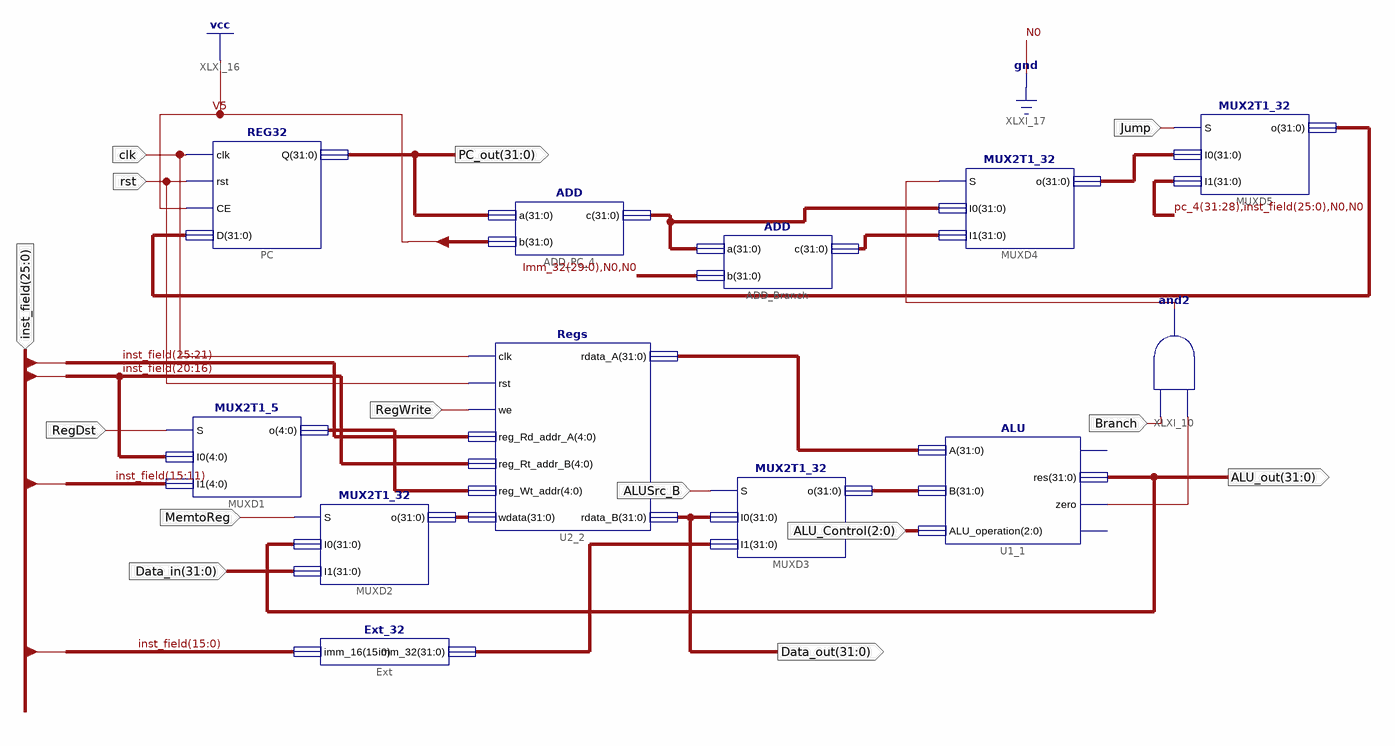
[diagram p0: schematic sheet 1]
// Xilinx ISE schematic Data_path.sch (kintex7) as structural Verilog: 12 symbols, 14 ports
module Data_path (
  input  clk,
  input  rst,
  input  Jump,
  input  Branch,
  input  [2:0] ALU_Control,
  input  [31:0] Data_in,
  input  MemtoReg,
  input  [25:0] inst_field,
  input  RegDst,
  input  RegWrite,
  input  ALUSrc_B,
  output [31:0] Data_out,
  output [31:0] PC_out,
  output [31:0] ALU_out
);

  wire XLXN_6, XLXN_8;
  wire [4:0] XLXN_1;
  wire [31:0] Imm_32, pc_4, XLXN_2, XLXN_4, XLXN_5, XLXN_7, XLXN_16, XLXN_19;

  REG32 PC (.clk(clk), .rst(rst), .CE(1'b1), .D(XLXN_19), .Q(PC_out));
  Regs U2_2 (
    .clk(clk), .rst(rst), .we(RegWrite), .reg_Rd_addr_A(inst_field[25:21]),
    .reg_Rt_addr_B(inst_field[20:16]), .reg_Wt_addr(XLXN_1), .wdata(XLXN_2), .rdata_A(XLXN_5),
    .rdata_B(Data_out));
  MUX2T1_32 MUXD2 (.S(MemtoReg), .I0(ALU_out), .I1(Data_in), .o(XLXN_2));
  MUX2T1_5 MUXD1 (.S(RegDst), .I0(inst_field[20:16]), .I1(inst_field[15:11]), .o(XLXN_1));
  MUX2T1_32 MUXD3 (.S(ALUSrc_B), .I0(Data_out), .I1(Imm_32), .o(XLXN_4));
  ALU U1_1 (.A(XLXN_5), .B(XLXN_4), .ALU_operation(ALU_Control), .res(ALU_out), .zero(XLXN_6));  // open: Co, overflow
  and XLXI_10 (XLXN_8, XLXN_6, Branch);
  ADD ADD_PC_4 (.a(PC_out), .b(32'b00000000000000000000000000000100), .c(pc_4));
  ADD ADD_Branch (.a(pc_4), .b({Imm_32[29:0], 2'b00}), .c(XLXN_16));
  MUX2T1_32 MUXD4 (.S(XLXN_8), .I0(pc_4), .I1(XLXN_16), .o(XLXN_7));
  MUX2T1_32 MUXD5 (.S(Jump), .I0(XLXN_7), .I1({pc_4[31:28], inst_field, 2'b00}), .o(XLXN_19));
  Ext_32 Ext (.imm_16(inst_field[15:0]), .imm_32(Imm_32));
endmodule
